# Altium schematic sheet EIT_Teensy.SchDoc
size A
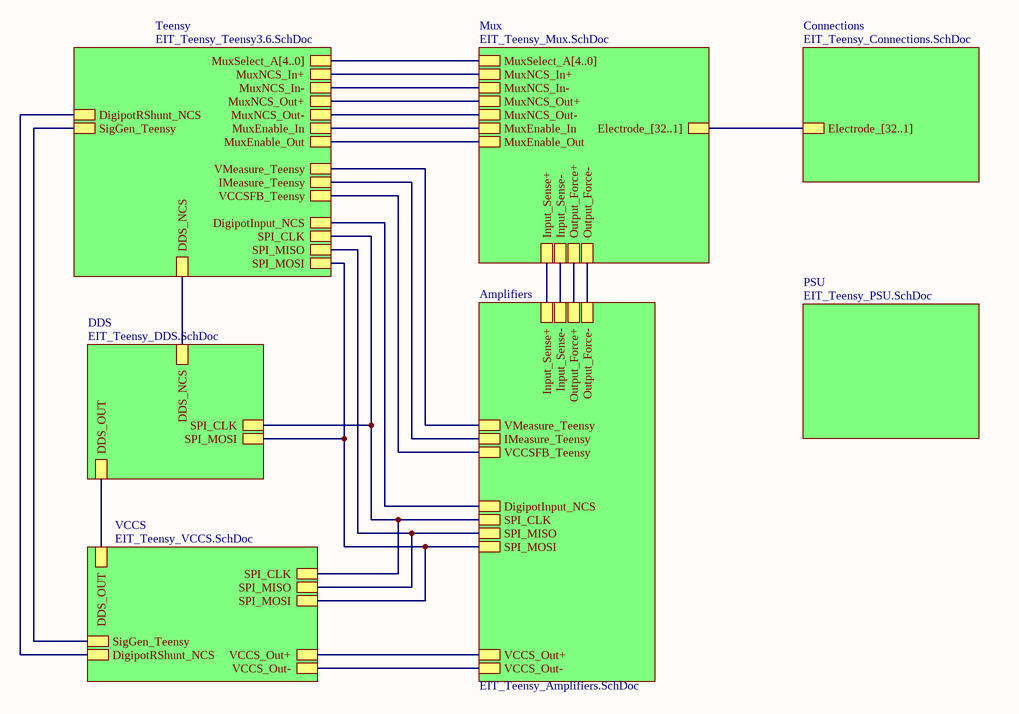
[diagram p0: EIT_Teensy.SchDoc]

## Sub-sheets
Amplifiers = EIT_Teensy_Amplifiers.SchDoc: IMeasure_Teensy, Input_Sense+, Input_Sense-, Output_Force+, Output_Force-, VCCS_Out+, VCCS_Out-, VMeasure_Teensy, VCCSFB_Teensy, DigipotInput_NCS, SPI_CLK, SPI_MISO, SPI_MOSI
Connections = EIT_Teensy_Connections.SchDoc: Electrode_[32..1]
DDS = EIT_Teensy_DDS.SchDoc: DDS_OUT, DDS_NCS, SPI_CLK, SPI_MOSI
Mux = EIT_Teensy_Mux.SchDoc: Electrode_[32..1], MuxSelect_A[4..0], Input_Sense+, Input_Sense-, Output_Force+, Output_Force-, MuxEnable_In, MuxEnable_Out, MuxNCS_In+, MuxNCS_In-, MuxNCS_Out+, MuxNCS_Out-
PSU = EIT_Teensy_PSU.SchDoc: no entries
Teensy = EIT_Teensy_Teensy3.6.SchDoc: MuxSelect_A[4..0], IMeasure_Teensy, VMeasure_Teensy, DDS_NCS, VCCSFB_Teensy, SigGen_Teensy, MuxEnable_In, MuxEnable_Out, DigipotRShunt_NCS, DigipotInput_NCS, SPI_CLK, SPI_MISO, SPI_MOSI, MuxNCS_In+, MuxNCS_In-, MuxNCS_Out+, MuxNCS_Out-
VCCS = EIT_Teensy_VCCS.SchDoc: DDS_OUT, VCCS_Out+, VCCS_Out-, SigGen_Teensy, DigipotRShunt_NCS, SPI_CLK, SPI_MISO, SPI_MOSI

## Nets
(unnamed): sheet Teensy/IMeasure_Teensy, sheet Amplifiers/IMeasure_Teensy
(unnamed): sheet Teensy/VMeasure_Teensy, sheet Amplifiers/VMeasure_Teensy
(unnamed): sheet Teensy/DDS_NCS, sheet DDS/DDS_NCS
(unnamed): sheet Teensy/VCCSFB_Teensy, sheet Amplifiers/VCCSFB_Teensy
(unnamed): sheet Teensy/SigGen_Teensy, sheet VCCS/SigGen_Teensy
(unnamed): sheet Teensy/MuxEnable_In, sheet Mux/MuxEnable_In
(unnamed): sheet Teensy/MuxEnable_Out, sheet Mux/MuxEnable_Out
(unnamed): sheet Teensy/DigipotRShunt_NCS, sheet VCCS/DigipotRShunt_NCS
(unnamed): sheet Teensy/DigipotInput_NCS, sheet Amplifiers/DigipotInput_NCS
(unnamed): sheet Teensy/SPI_CLK, sheet DDS/SPI_CLK, sheet VCCS/SPI_CLK, sheet Amplifiers/SPI_CLK
(unnamed): sheet Teensy/SPI_MISO, sheet VCCS/SPI_MISO, sheet Amplifiers/SPI_MISO
(unnamed): sheet Teensy/SPI_MOSI, sheet DDS/SPI_MOSI, sheet VCCS/SPI_MOSI, sheet Amplifiers/SPI_MOSI
(unnamed): sheet Teensy/MuxNCS_In+, sheet Mux/MuxNCS_In+
(unnamed): sheet Teensy/MuxNCS_In-, sheet Mux/MuxNCS_In-
(unnamed): sheet Teensy/MuxNCS_Out+, sheet Mux/MuxNCS_Out+
(unnamed): sheet Teensy/MuxNCS_Out-, sheet Mux/MuxNCS_Out-
(unnamed): sheet DDS/DDS_OUT, sheet VCCS/DDS_OUT
(unnamed): sheet Mux/Input_Sense+, sheet Amplifiers/Input_Sense+
(unnamed): sheet Mux/Input_Sense-, sheet Amplifiers/Input_Sense-
(unnamed): sheet Mux/Output_Force+, sheet Amplifiers/Output_Force+
(unnamed): sheet Mux/Output_Force-, sheet Amplifiers/Output_Force-
(unnamed): sheet VCCS/VCCS_Out+, sheet Amplifiers/VCCS_Out+
(unnamed): sheet VCCS/VCCS_Out-, sheet Amplifiers/VCCS_Out-

## Buses and harness runs
bus sheet Connections/Electrode_[32..1] = sheet Mux/Electrode_[32..1]
bus sheet Mux/MuxSelect_A[4..0] = sheet Teensy/MuxSelect_A[4..0]